# EAGLE design 5853-top-board (EAGLE 6.4)
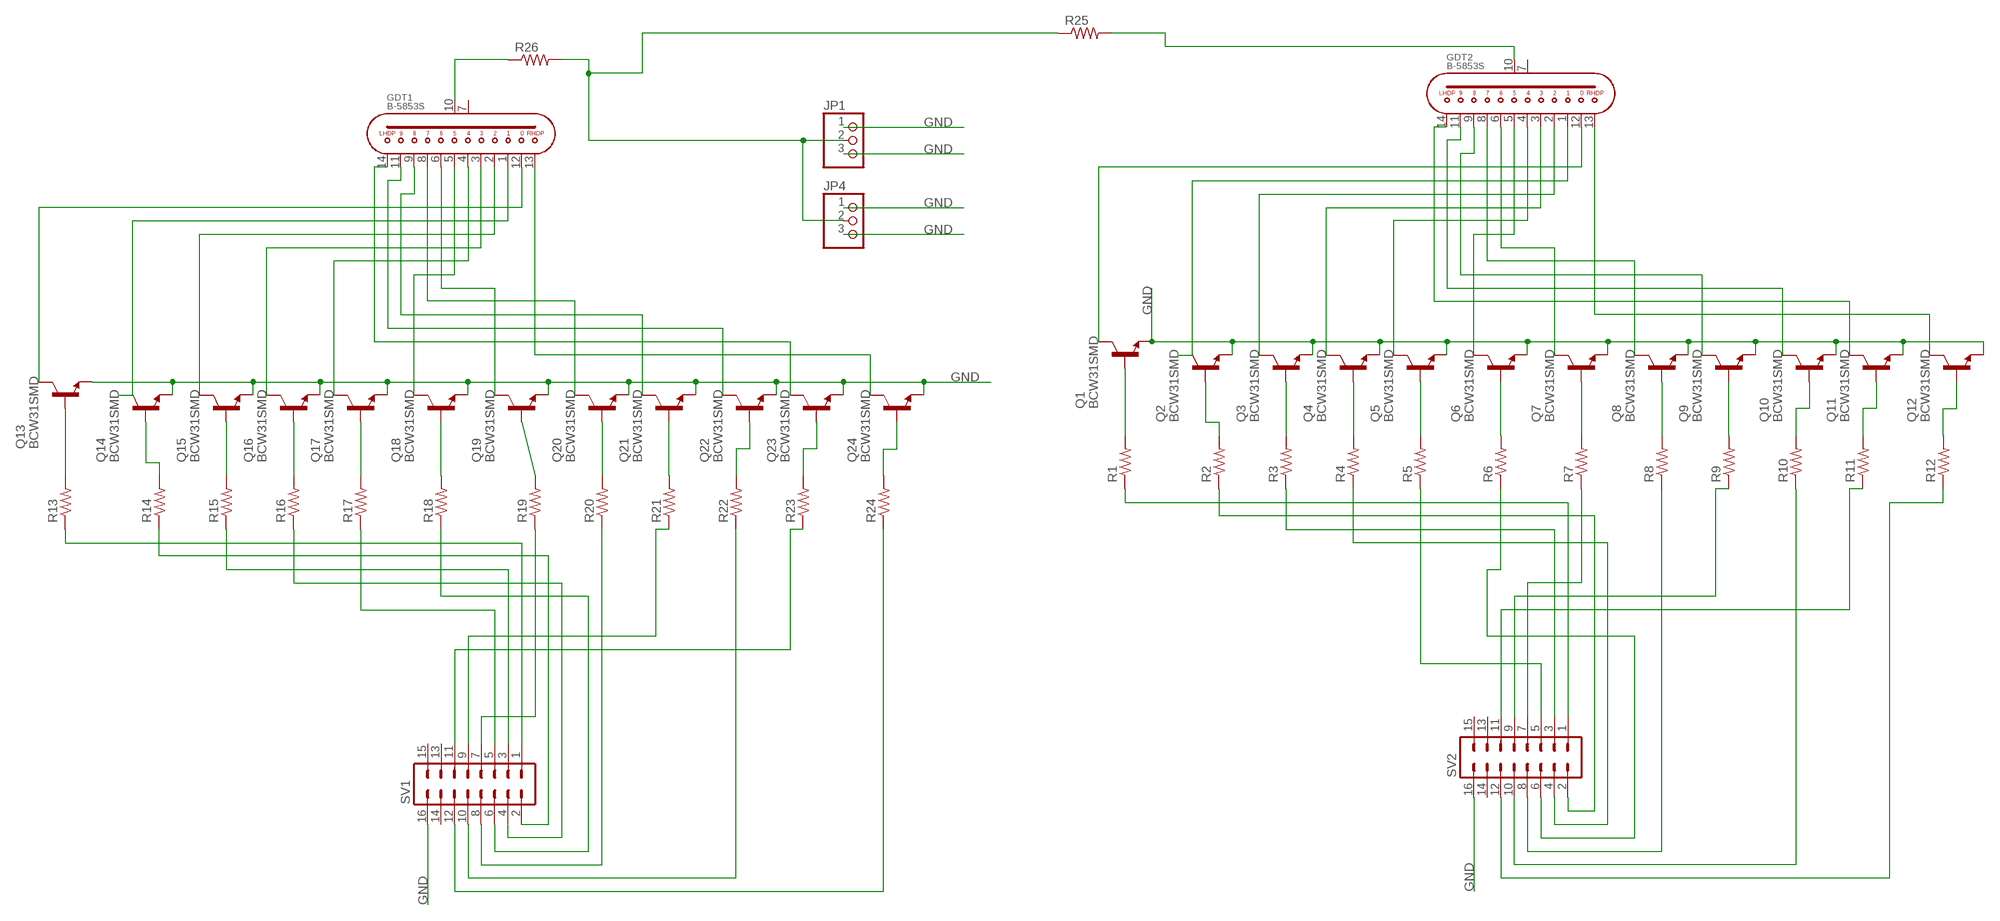
[diagram p0: schematic, sheet 1]

## Parts
GDT1  B-5853S  [SK-207]
GDT2  B-5853S  [SK-207]
JP1  PINHD-1X3  [1X03]
JP4  PINHD-1X3  [1X03]
Q1  BCW31SMD  [SOT23-BEC]
Q2  BCW31SMD  [SOT23-BEC]
Q3  BCW31SMD  [SOT23-BEC]
Q4  BCW31SMD  [SOT23-BEC]
Q5  BCW31SMD  [SOT23-BEC]
Q6  BCW31SMD  [SOT23-BEC]
Q7  BCW31SMD  [SOT23-BEC]
Q8  BCW31SMD  [SOT23-BEC]
Q9  BCW31SMD  [SOT23-BEC]
Q10  BCW31SMD  [SOT23-BEC]
Q11  BCW31SMD  [SOT23-BEC]
Q12  BCW31SMD  [SOT23-BEC]
Q13  BCW31SMD  [SOT23-BEC]
Q14  BCW31SMD  [SOT23-BEC]
Q15  BCW31SMD  [SOT23-BEC]
Q16  BCW31SMD  [SOT23-BEC]
Q17  BCW31SMD  [SOT23-BEC]
Q18  BCW31SMD  [SOT23-BEC]
Q19  BCW31SMD  [SOT23-BEC]
Q20  BCW31SMD  [SOT23-BEC]
Q21  BCW31SMD  [SOT23-BEC]
Q22  BCW31SMD  [SOT23-BEC]
Q23  BCW31SMD  [SOT23-BEC]
Q24  BCW31SMD  [SOT23-BEC]
R1  R-US_M0805  [M0805]
R2  R-US_M0805  [M0805]
R3  R-US_M0805  [M0805]
R4  R-US_M0805  [M0805]
R5  R-US_M0805  [M0805]
R6  R-US_M0805  [M0805]
R7  R-US_M0805  [M0805]
R8  R-US_M0805  [M0805]
R9  R-US_M0805  [M0805]
R10  R-US_M0805  [M0805]
R11  R-US_M0805  [M0805]
R12  R-US_M0805  [M0805]
R13  R-US_M0805  [M0805]
R14  R-US_M0805  [M0805]
R15  R-US_M0805  [M0805]
R16  R-US_M0805  [M0805]
R17  R-US_M0805  [M0805]
R18  R-US_M0805  [M0805]
R19  R-US_M0805  [M0805]
R20  R-US_M0805  [M0805]
R21  R-US_M0805  [M0805]
R22  R-US_M0805  [M0805]
R23  R-US_M0805  [M0805]
R24  R-US_M0805  [M0805]
R25  R-US_M0805  [M0805]
R26  R-US_M0805  [M0805]
SV1  ML16  [ML16]
SV2  ML16  [ML16]

## Nets
GND: JP1.1 JP1.3 JP4.1 JP4.3 Q1.E Q2.E Q3.E Q4.E Q5.E Q6.E Q7.E Q8.E Q9.E Q10.E Q11.E Q12.E Q13.E Q14.E Q15.E Q16.E Q17.E Q18.E Q19.E Q20.E Q21.E Q22.E Q23.E Q24.E SV1.16 SV2.16
N$1: R13.1 SV1.1
N$2: R14.1 SV1.2
N$3: R15.1 SV1.3
N$4: R16.1 SV1.4
N$5: R17.1 SV1.5
N$6: R18.1 SV1.6
N$7: R19.1 SV1.7
N$8: R20.1 SV1.8
N$9: R21.1 SV1.9
N$10: R22.1 SV1.10
N$11: R24.1 SV1.12
N$12: R23.1 SV1.11
N$13: JP1.2 JP4.2 R25.1 R26.2
N$15: GDT1.10 R26.1
N$16: Q1.B R1.2
N$18: GDT1.2 Q15.C
N$19: GDT1.4 Q17.C
N$20: GDT1.5 Q18.C
N$21: GDT1.6 Q19.C
N$22: GDT1.8 Q20.C
N$23: GDT1.9 Q21.C
N$24: GDT1.11 Q22.C
N$25: GDT1.14 Q23.C
N$26: GDT1.13 Q24.C
N$27: Q13.B R13.2
N$28: Q14.B R14.2
N$29: Q15.B R15.2
N$30: Q16.B R16.2
N$31: Q17.B R17.2
N$32: Q18.B R18.2
N$33: Q19.B R19.2
N$34: Q20.B R20.2
N$35: Q24.B R24.2
N$36: Q23.B R23.2
N$37: Q22.B R22.2
N$38: Q21.B R21.2
N$39: GDT1.12 Q13.C
N$40: Q2.B R2.2
N$41: Q3.B R3.2
N$42: Q4.B R4.2
N$43: Q5.B R5.2
N$44: Q6.B R6.2
N$45: Q7.B R7.2
N$46: Q8.B R8.2
N$47: Q12.B R12.2
N$48: Q11.B R11.2
N$49: Q10.B R10.2
N$50: Q9.B R9.2
N$51: GDT2.3 Q4.C
N$52: GDT2.4 Q5.C
N$53: GDT1.1 Q14.C
N$55: GDT1.3 Q16.C
N$56: GDT2.5 Q6.C
N$57: GDT2.6 Q7.C
N$58: GDT2.8 Q8.C
N$59: GDT2.9 Q9.C
N$61: GDT2.11 Q10.C
N$62: GDT2.14 Q11.C
N$63: GDT2.13 Q12.C
N$64: GDT2.1 Q2.C
N$65: GDT2.2 Q3.C
N$66: GDT2.12 Q1.C
N$67: R2.1 SV2.2
N$68: R3.1 SV2.3
N$70: R4.1 SV2.4
N$71: R5.1 SV2.5
N$72: R12.1 SV2.12
N$73: R7.1 SV2.7
N$74: R8.1 SV2.8
N$75: R9.1 SV2.9
N$76: R10.1 SV2.10
N$77: R11.1 SV2.11
N$81: R6.1 SV2.6
N$82: R1.1 SV2.1
N$83: GDT2.10 R25.2
Unconnected: GDT1.7 GDT2.7 SV1.13 SV1.14 SV1.15 SV2.13 SV2.14 SV2.15

## Library data of the parts
GDT1 GDT2 = 0-burroughs:B-5853S: B-5853S The low priced side-viewing Nixie tube, high quality, cold-cathode indicator tube having a common anode. It can display the numerals 0-9 and have two decimal points. 170Vdc, 14ma, 0.5w
JP1 JP4 = pinhead:PINHD-1X3: PIN HEADER
Q1-Q24 = transistor-npn:BCW31*: NPN Transistor
R1-R26 = resistor:R-US_: RESISTOR, American symbol
SV1 SV2 = con-ml:ML16: HARTING; OC_FARNELL: unknown; OC_NEWARK: unknown

## Board
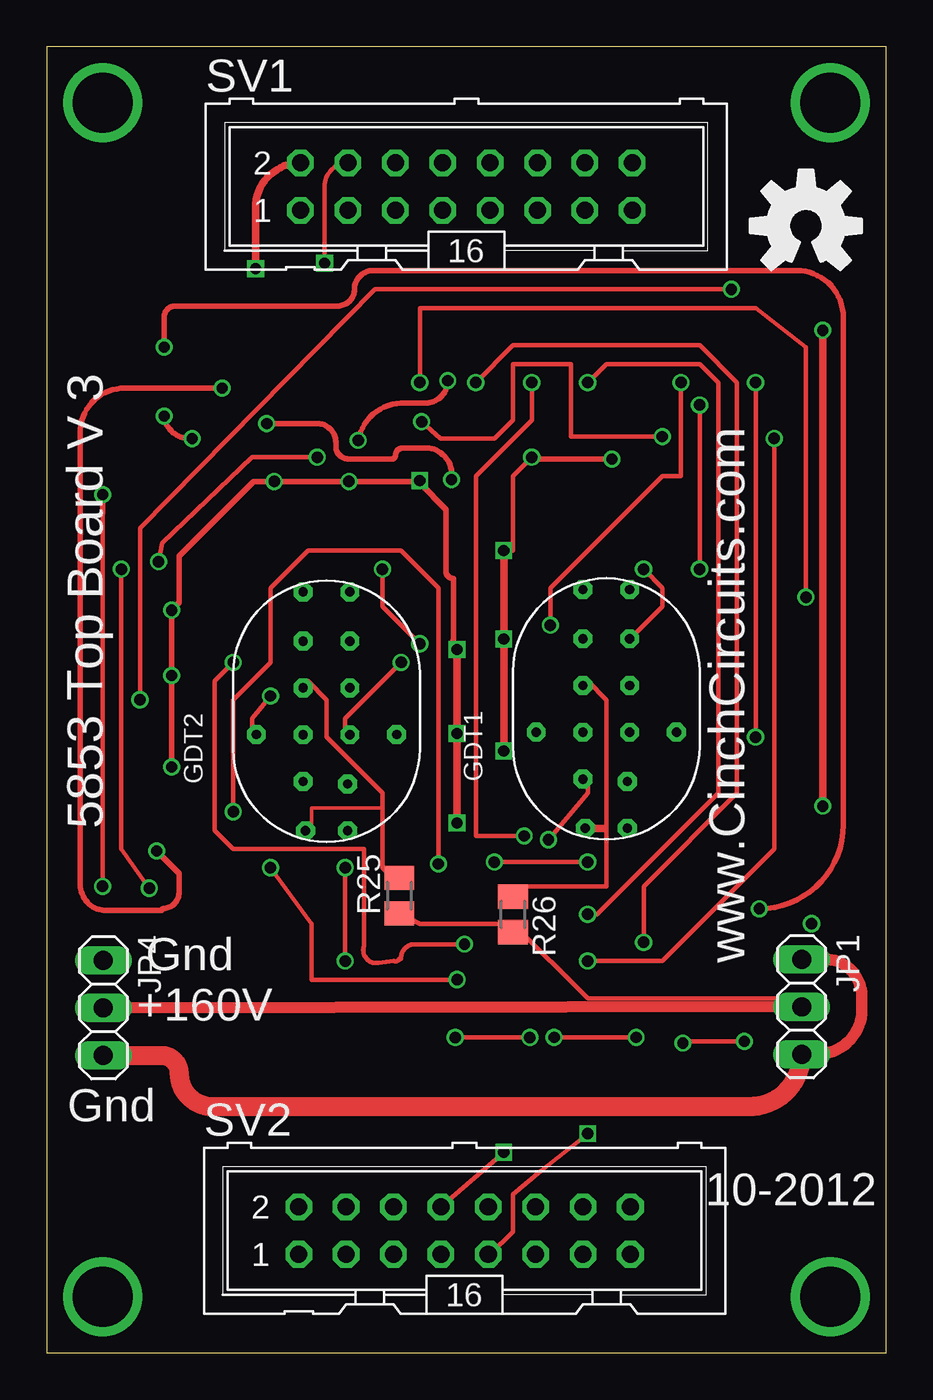
[diagram p1: board, top side]
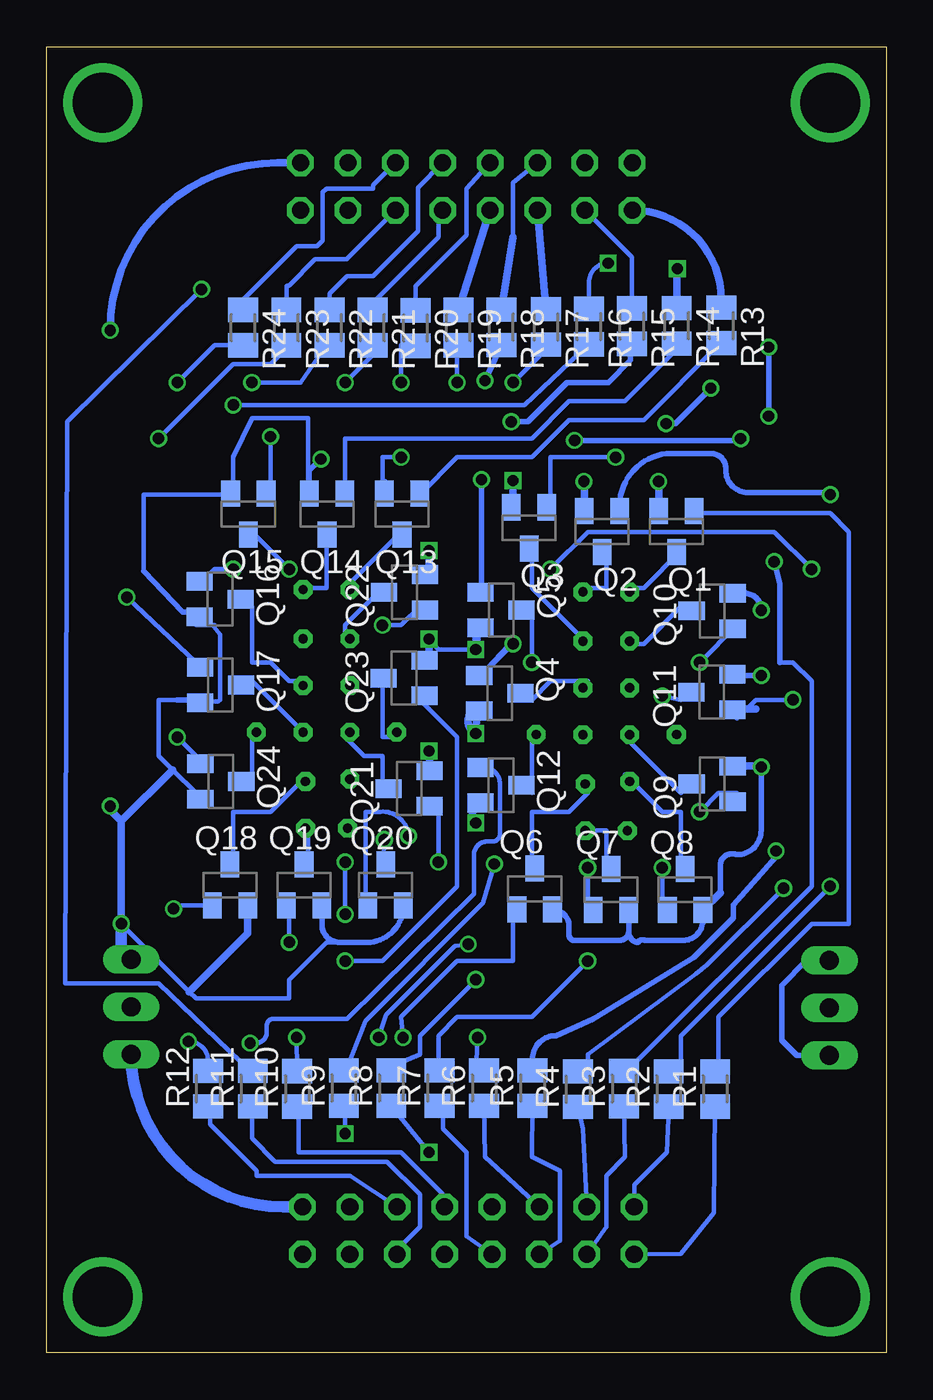
[diagram p2: board, bottom side, seen from below]

Size 45 x 70 mm. Coordinates in mm from the lower left corner, seen from the top.
Outline: 0,0 45,0 45,70 0,70 0,0
Copper layers (1*16): Top 0.035mm / dielectric 1.5mm / Bottom 0.035mm
Design rules "Fusion_eagle_rule_v1.1": minimum track width 6mil, minimum drill 12mil, track to track 6mil, track to pad 6mil, pad to pad 6mil, via to via 6mil, smd to smd 0mil, copper to edge 10mil, drill to drill 10mil, minimum pad ring 10mil, minimum via ring 6mil, stop-mask expansion 2mil, vias tented up to drill 100mil, thermal gap 10mil

### Footprints (pad centres in the part's own frame; a part is rotated, then mirrored left to right if it is on the bottom)
SK-207 = drill 0.5 octagon: 1 1.254,6.397; 2 1.254,3.762; 3 1.254,1.254; 4 1.254,-1.254; 5 1.127,-3.889; 6 1.127,-6.397; 7 -1.127,-6.397; 8 -1.254,-3.762; 9 -1.254,-1.254; 10 -1.254,1.254; 11 -1.254,3.762; 12 -1.254,6.397; 13 3.762,-1.246; 14 -3.762,-1.246
1X03 = drill 1.016 long: 1 -2.54,0; 2 0,0; 3 2.54,0
SOT23-BEC = smd 1 x 1.4: B -0.95,-1.1; C 0,1.1; E 0.95,-1.1
M0805 = smd 1.3 x 1.6: 1 -0.95,0; 2 0.95,0
ML16 = drill 0.914 octagon: 1 -8.89,-1.27; 2 -8.89,1.27; 3 -6.35,-1.27; 4 -6.35,1.27; 5 -3.81,-1.27; 6 -3.81,1.27; 7 -1.27,-1.27; 8 -1.27,1.27; 9 1.27,-1.27; 10 1.27,1.27; 11 3.81,-1.27; 12 3.81,1.27; 13 6.35,-1.27; 14 6.35,1.27; 15 8.89,-1.27; 16 8.89,1.27

### Placement (x,y rotation side)
GDT1  30,34.51 0 top
GDT2  15,34.38 0 top
JP1  40.47,18.54 270 top
JP4  3.04,18.48 270 top
Q1  11.24,44.01 180 bottom
Q2  15.23,44.01 180 bottom
Q3  19.14,44.21 180 bottom
Q4  20.71,35.35 270 bottom
Q5  20.64,39.81 270 bottom
Q6  18.84,24.86 0 bottom
Q7  14.75,24.83 0 bottom
Q8  10.78,24.83 0 bottom
Q9  9.33,30.49 90 bottom
Q10  9.33,39.76 90 bottom
Q11  9.35,35.41 90 bottom
Q12  20.65,30.42 270 bottom
Q13  25.95,44.95 180 bottom
Q14  29.97,44.95 180 bottom
Q15  34.19,44.95 180 bottom
Q16  35.7,40.39 270 bottom
Q17  35.68,35.79 270 bottom
Q18  35.17,25.07 0 bottom
Q19  31.2,25.07 0 bottom
Q20  26.83,25.07 0 bottom
Q21  25.57,30.24 90 bottom
Q22  25.82,40.76 90 bottom
Q23  25.84,36.16 90 bottom
Q24  35.66,30.62 270 bottom
R1  9.17,14.14 90 bottom
R2  11.66,14.14 90 bottom
R3  14.05,14.16 90 bottom
R4  16.52,14.13 90 bottom
R5  18.96,14.19 90 bottom
R6  21.55,14.19 90 bottom
R7  23.94,14.19 90 bottom
R8  26.53,14.19 90 bottom
R9  29.07,14.19 90 bottom
R10  31.57,14.15 90 bottom
R11  33.95,14.16 90 bottom
R12  36.34,14.16 90 bottom
R13  8.83,55.06 270 bottom
R14  11.23,55.04 270 bottom
R15  13.63,55.02 270 bottom
R16  15.93,55 270 bottom
R17  18.23,54.98 270 bottom
R18  20.63,54.96 270 bottom
R19  22.93,54.94 270 bottom
R20  25.23,54.92 270 bottom
R21  27.54,54.94 270 bottom
R22  29.83,54.94 270 bottom
R23  32.15,54.94 270 bottom
R24  34.47,54.94 270 bottom
R25  18.9,24.5 90 top
R26  25,23.5 270 top
SV1  22.5,62.5 0 top
SV2  22.4,6.55 0 top

### Tracks (layer width: path | path; a pad name or v marks a point on that pad's centre or on a via)
GND  (via drill 0.6, 0.61)
  Top 0.254: v26,48 25,47 25,43 v24.5,43
  Top 0.305: v6.7,31.4 v6.7,36.3 v6.7,39.8 7.1,40.2 7.1,42.7 11.1,46.7 v12.2,46.7 v16.2,46.7 19.95,46.7 v20,46.75 20,46.6 21.4,45.2 21.4,41.9 arc90 21.8,41.5 21.8,38.2 arc90 v22,37.7 | v30.3,47.9 26.1,47.9 v26,48
  Top 0.406: v22,37.7 v22,33.2 v22,28.4 | v24.5,32.25 v24.5,38.25 v24.5,43 | v41.6,54.8 v41.6,29.3
  Top 0.61: JP1.3 41.3,16 arc90 43.7,18.4 43.7,19.1 arc90 41.7,21.1 40.49,21.1 arc90 JP1.1
  Top 1.016: JP4.3 6.16,15.94 arc-90 7.1,15 arc90 8.9,13.2 37.67,13.2 arc90 JP1.3
  Bottom 0.254: v22,37.7 24,37.7 v24.5,38.25 | Q24.E 37,30 38.25,31.25 39,32 39,35 37,35 Q17.E 36.72,34.9 35.8,34.9 35.7,35 35.7,38.5 36.44,39.44 Q16.E 37,39 36,39 | 41,22 41,22.5 v41,23 37.35,19.35 37,19 32,19 32,20 30,22 29,22 | v26,48 27,48 27,46 Q13.E | 35,46 35,48 34,50.1 31,50.1 31,46 Q14.E | 39.8,41.9 39.8,46 35,46 | 35,46 Q15.E
  Bottom 0.305: Q20.E arc90 27.85,22 29,22 29.3,22 arc90 30.25,22.95 Q19.E | Q18.E 34.22,23.88 | 6.74,31.44 arc90 v6.7,31.4 6.7,28 arc90 8,26.7 arc-113 8.9,26.1 8.9,24.66 | v6.7,36.3 8.19,36.3 | 7.61,40.71 arc90 v6.7,39.8 | v12.19,46.69 arc-90 v12.2,46.7 | 16.18,46.68 v16.2,46.7 | Q14.E 30.92,47.28 v30.3,47.9 | 39.8,41.9 37.7,39.7 37.06,39.7 Q16.E | 37,35 38,35 | Q6.E arc90 17,22.87 17,22.4 arc-90 16.7,22.1 14.3,22.1 arc-90 13.8,22.6 | 13.8,22.6 Q7.E | Q8.E 9.83,23.17 arc90 10.9,22.1 12.9,22.1 arc-90 13.3,22 arc90 13.8,22.6 | JP4.1 4.28,21.02 5.6,19.7 5.6,16.74 4.8,15.94 JP4.3
  Bottom 0.406: v20,46.75 20,45.4 Q3.E | 22,38.61 v22,37.7 21.88,39 Q5.E | 22.35,34.15 arc-90 v22,33.2 21.96,34.25 Q4.E | v22,28.4 arc90 22.03,29.22 22,29.22 Q12.E | Q21.E 24.47,32.22 v24.5,32.25 | v24.5,38.25 24.5,37.35 Q23.E | v24.5,43 24.5,41.93 Q22.E | Q13.E 26.9,46.65 | SV1.16 32.63,63.77 arc-90 v41.6,54.8 | v41,23 41,28.5 | 41,28.5 38.25,31.25 | v41.6,29.3 41.6,29.1 41,28.5 | Q8.E 8.9,24.66 | 6.74,31.44 Q9.E | Q10.E 7.61,40.71 | Q11.E 8.19,36.3 | 34.22,23.88 34.22,22.48 37.35,19.35 | v12.19,46.69 Q1.E | 16.18,46.68 Q2.E
  Bottom 0.61: SV2.16 32.29,7.82 arc90 JP1.3 | JP1.1 41,21.08 41,22.5
N$1
  Bottom 0.406: SV1.1 arc90 8.83,56.45 R13.1
N$2  (via drill 0.6)
  Top 0.406: SV1.2 arc90 11.2,61.36 v11.2,58.1
  Bottom 0.406: v11.2,58.1 arc-90 11.23,58.07 R14.1
N$3
  Bottom 0.254: SV1.3 13.63,58.71 R15.1
N$4  (via drill 0.6)
  Top 0.254: SV1.4 arc90 14.9,62.52 v14.9,58.4
  Bottom 0.254: v14.9,58.4 arc-90 15.93,57.37 R16.1
N$5
  Bottom 0.406: R17.1 SV1.5
N$6
  Bottom 0.254: 20,59.8 20,62.7 SV1.6
  Bottom 0.406: R18.1 20,59.8
N$7
  Bottom 0.406: R19.1 SV1.7
N$8
  Bottom 0.254: SV1.8 22.5,62.4 22.5,59.9 25.23,57.17 R20.1
N$9
  Bottom 0.254: SV1.9 24,61 24,59.8 27.54,56.26 R21.1
N$10
  Bottom 0.254: SV1.10 25.1,62.44 25.1,60.1 27.5,57.7 28.9,57.7 29.83,56.77 R22.1
N$11
  Bottom 0.254: SV1.12 27.5,62.58 27.5,62.4 30,62.4 30.2,62.2 30.2,59.6 30.5,59.3 31.6,59.3 34.47,56.43 R24.1
N$12
  Bottom 0.254: SV1.11 28.9,58.64 28.9,58.6 30.6,58.6 32,57.2 32.1,57.2 32.15,57.15 R23.1
N$13
  Top 0.254: 25,23 20,23 R25.1 | 25,23 29,19 40,19 JP1.2 | 25,23 R26.2
  Top 0.61: JP4.2 40.31,18.58 arc90 JP1.2
N$15
  Top 0.254: R26.1 25,25 30,25 30,35 29,36 GDT1.10
N$16
  Bottom 0.254: Q1.B 10,45 3,45 2,44 2,23 4,23 9,18 9,15 R1.2
N$18  (via drill 0.61)
  Top 0.254: v32,42 33,41 33,40 31,38 GDT1.2
  Bottom 0.254: v32,42 34,44 Q15.C
N$19
  Bottom 0.254: Q17.C 34,36 31,33 GDT1.4
N$20
  Bottom 0.254: Q18.C 35,26 35,29 33,29 31,31 GDT1.5
N$21
  Bottom 0.254: Q19.C 31,26 31,28 GDT1.6
N$22  (via drill 0.61)
  Top 0.254: v26.9,27.5 29,30 29,31 GDT1.8
  Bottom 0.254: v26.9,27.5 27,26 Q20.C
N$23
  Bottom 0.254: Q21.C 27,30 27,32 28,32 29,33 GDT1.9
N$24
  Bottom 0.254: Q22.C 27,41 29,39 29,38 GDT1.11
N$25
  Bottom 0.254: Q23.C 27,36 27,33 26,33 GDT1.14
N$26
  Bottom 0.254: Q24.C 34,31 34,33 GDT1.13
N$27
  Bottom 0.254: Q13.B 25,46 23,48 19,48 17,50 13,50 9,54 R13.2
N$28
  Bottom 0.254: Q14.B 29,46 29,49 19,49 17,51 14,51 11,54 R14.2
N$29  (via drill 0.61)
  Top 0.254: v33,49.1 28.1,49.1 28.1,53 25,53 25,50 24,49 21.1,49 v20.1,49.9
  Bottom 0.254: v33,49.1 33,46 Q15.B | 14,54 R15.2
  Bottom 0.305: v20.1,49.9 19.2,49.9 17.1,52 14.9,52 13.7,53.2 13.7,54 R15.2
N$30  (via drill 0.61)
  Top 0.254: v35,50.8 v35,42
  Bottom 0.254: v35,42 36,42 37,41 Q16.B | v35,50.8 19.4,50.8 16,54 R16.2
N$31  (via drill 0.61)
  Top 0.254: v40.7,40.5 40.7,53.9 38,56 20,56 v20,52
  Bottom 0.254: v40.7,40.5 37,37 Q17.B | v20,52 18,54 R17.2
N$32  (via drill 0.6)
  Top 0.305: v38.2,23.8 arc90 42.7,28.3 42.7,55.5 arc90 40.2,58 17.5,58 arc90 16.5,57 arc-90 15.6,56.1 6.9,56.1 arc90 6.3,55.5 v6.3,53.9 | v6.3,50.2 arc90 v7.8,49 | v21.5,52.1 arc-90 20.3,50.9 19,50.9 arc76 v16.7,48.9
  Bottom 0.254: Q18.B 38.03,23.97 v38.2,23.8
  Bottom 0.305: R18.2 v21.5,52.1 | v16.7,48.9 7.8,48.9 v7.8,49 | v6.3,50.2 v6.3,53.9
N$33  (via drill 0.61)
  Top 0.254: v32,22 32,25 37,30 37,52 35,54 25,54 v23,52
  Bottom 0.254: v32,22 32,24 Q19.B | v23,52 23,54 R19.2
N$34  (via drill 0.6, 0.61)
  Top 0.254: v26,52 26,50 23,47 23,27.7 v25.6,27.7
  Bottom 0.254: v26,52 26,54 R20.2 | Q20.B 27.9,24 27.9,29 27.1,29 arc90 v25.6,27.7
N$35  (via drill 0.61)
  Top 0.254: v38,52 v38,33
  Bottom 0.254: v38,33 37,32 Q24.B | v38,52 36,54 35,54 R24.2
N$36  (via drill 0.61)
  Top 0.254: v29,21 33,21 39,27 v39,49
  Bottom 0.254: v29,21 27,21 23,25 23,33 25,35 Q23.B | v39,49 35,53 33,53 32,54 R23.2
N$37  (via drill 0.61)
  Top 0.254: v27,39 27,41 33,47 34,47 v34,52
  Bottom 0.254: v27,39 26,39 25,40 Q22.B | v34,52 31.4,52 30,54 R22.2
N$38  (via drill 0.61)
  Top 0.254: v29,26.3 v24,26.3 | v29,23.5 29.5,23.5 36,30 36,52 35,53 30,53 v29,52
  Bottom 0.254: v24,26.3 24,29 Q21.B | v29,23.5 v29,26.3 | v29,52 27,54 R21.2
N$39
  Bottom 0.254: Q13.C 26,44 29,41 GDT1.12
N$40  (via drill 0.6, 0.61)
  Top 0.254: v3,25 3,45
  Top 0.305: v3,46 3,45
  Bottom 0.254: v3,25 11,17 11,15 R2.2
  Bottom 0.305: Q2.B 14.28,45.42 arc90 11.5,48.2 9.4,48.2 arc90 8.6,47.4 8.6,47.3 arc-90 7.4,46.1 3.1,46.1 arc90 v3,46
N$41  (via drill 0.61)
  Top 0.254: v14.5,48 11,48 6.2,43.4 v6,42.4
  Bottom 0.254: v14.5,48 18,48 18,46 Q3.B | 5.7,37 5,37 4,36 4,25 14,15 R3.2
  Bottom 0.305: v6,42.4 5.7,41.2 5.7,37
N$42  (via drill 0.61)
  Top 0.254: v5.5,24.9 4,27 v4,42 | v18,42 18,40 v20,38
  Bottom 0.2: Q4.B 20.3,37.9
  Bottom 0.254: v5.5,24.9 9.6,20.8 10.2,20.3 16,16 16,15 R4.2 | v4,42 6,44 16,44 v18,42 | v20,38 22,36 Q4.B
N$43  (via drill 0.6)
  Top 0.305: v21.7,46.8 arc90 20.5,48.5 19.1,48.5 arc90 18.7,48.1 arc-90 18.5,47.9 16.2,47.9 arc-90 15.5,48.6 15.5,48.8 arc90 14.5,49.8 v11.8,49.8 | v9.4,51.7 4.2,51.7 arc90 1.8,49.3 1.8,25.1 arc90 3.2,23.7 6.1,23.7 arc90 6.2,23.8 arc90 7.1,24.7 7.1,25.7 v5.9,26.9
  Bottom 0.305: Q5.B 21.7,40.76 v21.7,46.8 | v11.8,49.8 11.3,49.8 v9.4,51.7 | v5.9,26.9 5.9,26.6 8.2,24 8.2,23.3 10.3,21.2 15.7,17.9 17.7,17 arc-90 18.96,15.74 R5.2
N$44  (via drill 0.61)
  Top 0.254: v21.9,16.9 v25.9,16.9
  Bottom 0.254: v25.9,16.9 26,18 23,21 20,21 20,24 Q6.B | v21.9,16.9 22,15 R6.2
N$45  (via drill 0.61)
  Top 0.254: v16,21 v16,26
  Bottom 0.254: v16,26 16,24 Q7.B | v16,21 19,18 23,18 24,17 24,15 R7.2
N$46  (via drill 0.61)
  Top 0.254: v12,26 14.2,23 14.2,20 v22,20
  Bottom 0.254: v12,26 12,24 Q8.B | v22,20 25,17 25,16 26.2,15.5 R8.2
N$47  (via drill 0.6)
  Top 0.254: v37.4,16.7 34.2,16.7 arc90 v34.1,16.6
  Bottom 0.254: R12.2 36.34,15.64 arc-90 v37.4,16.7 | v34.1,16.6 33.8,16.6 arc-90 33.2,17.2 33.2,17.4 arc90 32.9,17.9 28.9,17.9 22.1,24.6 22.1,26.7 arc90 21.4,27.4 21.1,27.4 arc-90 20.7,27.8 20.7,30.5 arc-90 21.57,31.37 Q12.B
N$48  (via drill 0.61)
  Top 0.254: v5,35 5,44.2 17.6,57 v36.7,57
  Bottom 0.254: v5,35 7,35 8,34 Q11.B | v36.7,57 43.9,49.9 44,19.8 39,19.8 34,15 R11.2
  Bottom 0.406: Q11.B arc90 8.21,34.5 7,34.5
N$49  (via drill 0.6, 0.61)
  Top 0.254: v10,37 9,36 9,28 10,27 17,27 17,21.8 arc90 17.5,20.9 17.8,20.9 18.6,21 arc90 18.9,21.1 19,21.1 arc-90 19.7,21.9 v22.4,21.9 | v31.6,16.9 v27.2,16.9
  Bottom 0.254: v10,37 8,39 Q10.B | R10.2 v31.6,16.9 | v27.2,16.9 26.8,18.1 23.1,21.8 v22.4,21.9
  Bottom 0.406: R10.2 arc90 31.75,15.28
N$50  (via drill 0.61)
  Top 0.254: v10,29 10,35 12,37 12,41 14,43 19,43 21,41 v21,26.2
  Bottom 0.254: v10,29 9,30 8,30 Q9.B | v21,26.2 21.6,24.1 27.9,17.8 29,15 R9.2
N$51
  Bottom 0.254: Q4.C 19,35 18,36 16,36 GDT2.3
N$52  (via drill 0.61)
  Top 0.254: v19,37 16,34 16,33 GDT2.4
  Bottom 0.254: v19,37 19,40 Q5.C
N$53
  Bottom 0.254: Q14.C 30,44 30,41 31,41 GDT1.1
N$54  (via drill 3.2 pad 3.81)
  other vias: 3,3
N$55
  Bottom 0.254: Q16.C 34,40 34,37 33,37 32,36 31,36 GDT1.3
N$56
  Bottom 0.254: Q6.C 19,26 19,29 17,29 16,30 GDT2.5
N$57
  Bottom 0.254: Q7.C 15,26 15,28 16,28 GDT2.6
N$58
  Bottom 0.254: Q8.C 11,26 11,29 12,29 14,31 GDT2.8
N$59
  Bottom 0.254: Q9.C 11,30 14,33 GDT2.9
N$60
  Top 0.406: 29.9,28.1 29,28.1
N$61
  Bottom 0.254: Q10.C 11,40 13,38 14,38 GDT2.11
N$62  (via drill 0.61)
  Top 0.254: v12,35.2 11,34 11,33 GDT2.14
  Bottom 0.254: v12,35.2 11,35 Q11.C
N$63
  Bottom 0.254: Q12.C 19,30 19,33 GDT2.13
N$64
  Bottom 0.254: Q2.C 15,43 15,41 16,41 GDT2.1
N$65
  Bottom 0.254: Q3.C 19,43 19,41 16,38 GDT2.2
N$66
  Bottom 0.254: Q1.C 11,43 13,41 14,41 GDT2.12
N$67
  Bottom 0.254: SV2.2 13.5,9 11.75,10.75 R2.1
N$68
  Bottom 0.254: SV2.3 15,6.75 15,9.5 14,10.5 R3.1
N$69
  Top 0.2: 41.49,58.49 arc9 41.79,58.65 42.55,58.04 43.06,58.55 42.45,59.31 arc19 42.71,59.94 43.68,60.03 43.68,60.77 42.71,60.86 arc19 42.45,61.49 43.06,62.25 42.55,62.76 41.79,62.15 arc19 41.16,62.41 41.07,63.38 40.33,63.38 40.24,62.41 arc19 39.61,62.15 38.85,62.76 38.34,62.25 38.95,61.49 arc19 38.69,60.86 37.72,60.77 37.72,60.03 38.69,59.94 arc19 38.95,59.31 38.34,58.55 38.85,58.04 39.61,58.65 arc9 39.91,58.49 40.34,59.53 arc-68 39.76,60.4 arc-248 41.06,59.53 41.49,58.49
N$70
  Bottom 0.254: SV2.4 16.25,12 R4.1
N$71
  Bottom 0.254: SV2.5 17.5,6 17.5,9.75 19,10.5 R5.1
N$72
  Bottom 0.254: SV2.12 28.75,9.5 33.75,9.5 33.75,9.75 36.25,12.25 36.25,13.12 R12.1
N$73
  Bottom 0.254: SV2.7 22.5,6.25 22.5,10.75 23.75,12 23.75,13.05 R7.1
N$74  (via drill 0.6)
  Top 0.254: SV2.8 v24.5,10.75
  Bottom 0.254: v24.5,10.75 R8.1
N$75  (via drill 0.6)
  Top 0.254: SV2.9 23.77,5.27 25,6.5 25,8.5 26.5,9.75 v29,11.75
  Bottom 0.254: v29,11.75 29,13.17 R9.1
N$76
  Bottom 0.254: SV2.10 23.77,8.52 26,10.75 31.5,10.75 31.5,13.13 R10.1
N$77
  Bottom 0.254: SV2.11 26.31,5.44 25,6.75 25,8.5 26.75,10.25 32.75,10.25 34,11.5 34,13.16 R11.1
N$78  (via drill 3.2)
  other vias: 42,3
N$79  (via drill 3.2)
  other vias: 42,67
N$80  (via drill 3.2)
  other vias: 3,67
N$81
  Bottom 0.254: SV2.6 21.5,10.5 R6.1
N$82
  Bottom 0.254: SV2.1 11,5.3 9.25,7.5 R1.1
N$83
  Top 0.2: 14.2,28 14.2,29.2 18,29.2
  Top 0.254: R25.2 19,25 18,26 18,29.2 18,30 15,33 15,35 14,36 GDT2.10

### Text on the board
tPlace: 5853 Top Board V 3 | www.CinchCircuits.com | Gnd | +160V | Gnd | 10-2012